# EAGLE schematic k-25m (EAGLE 7.5.0)
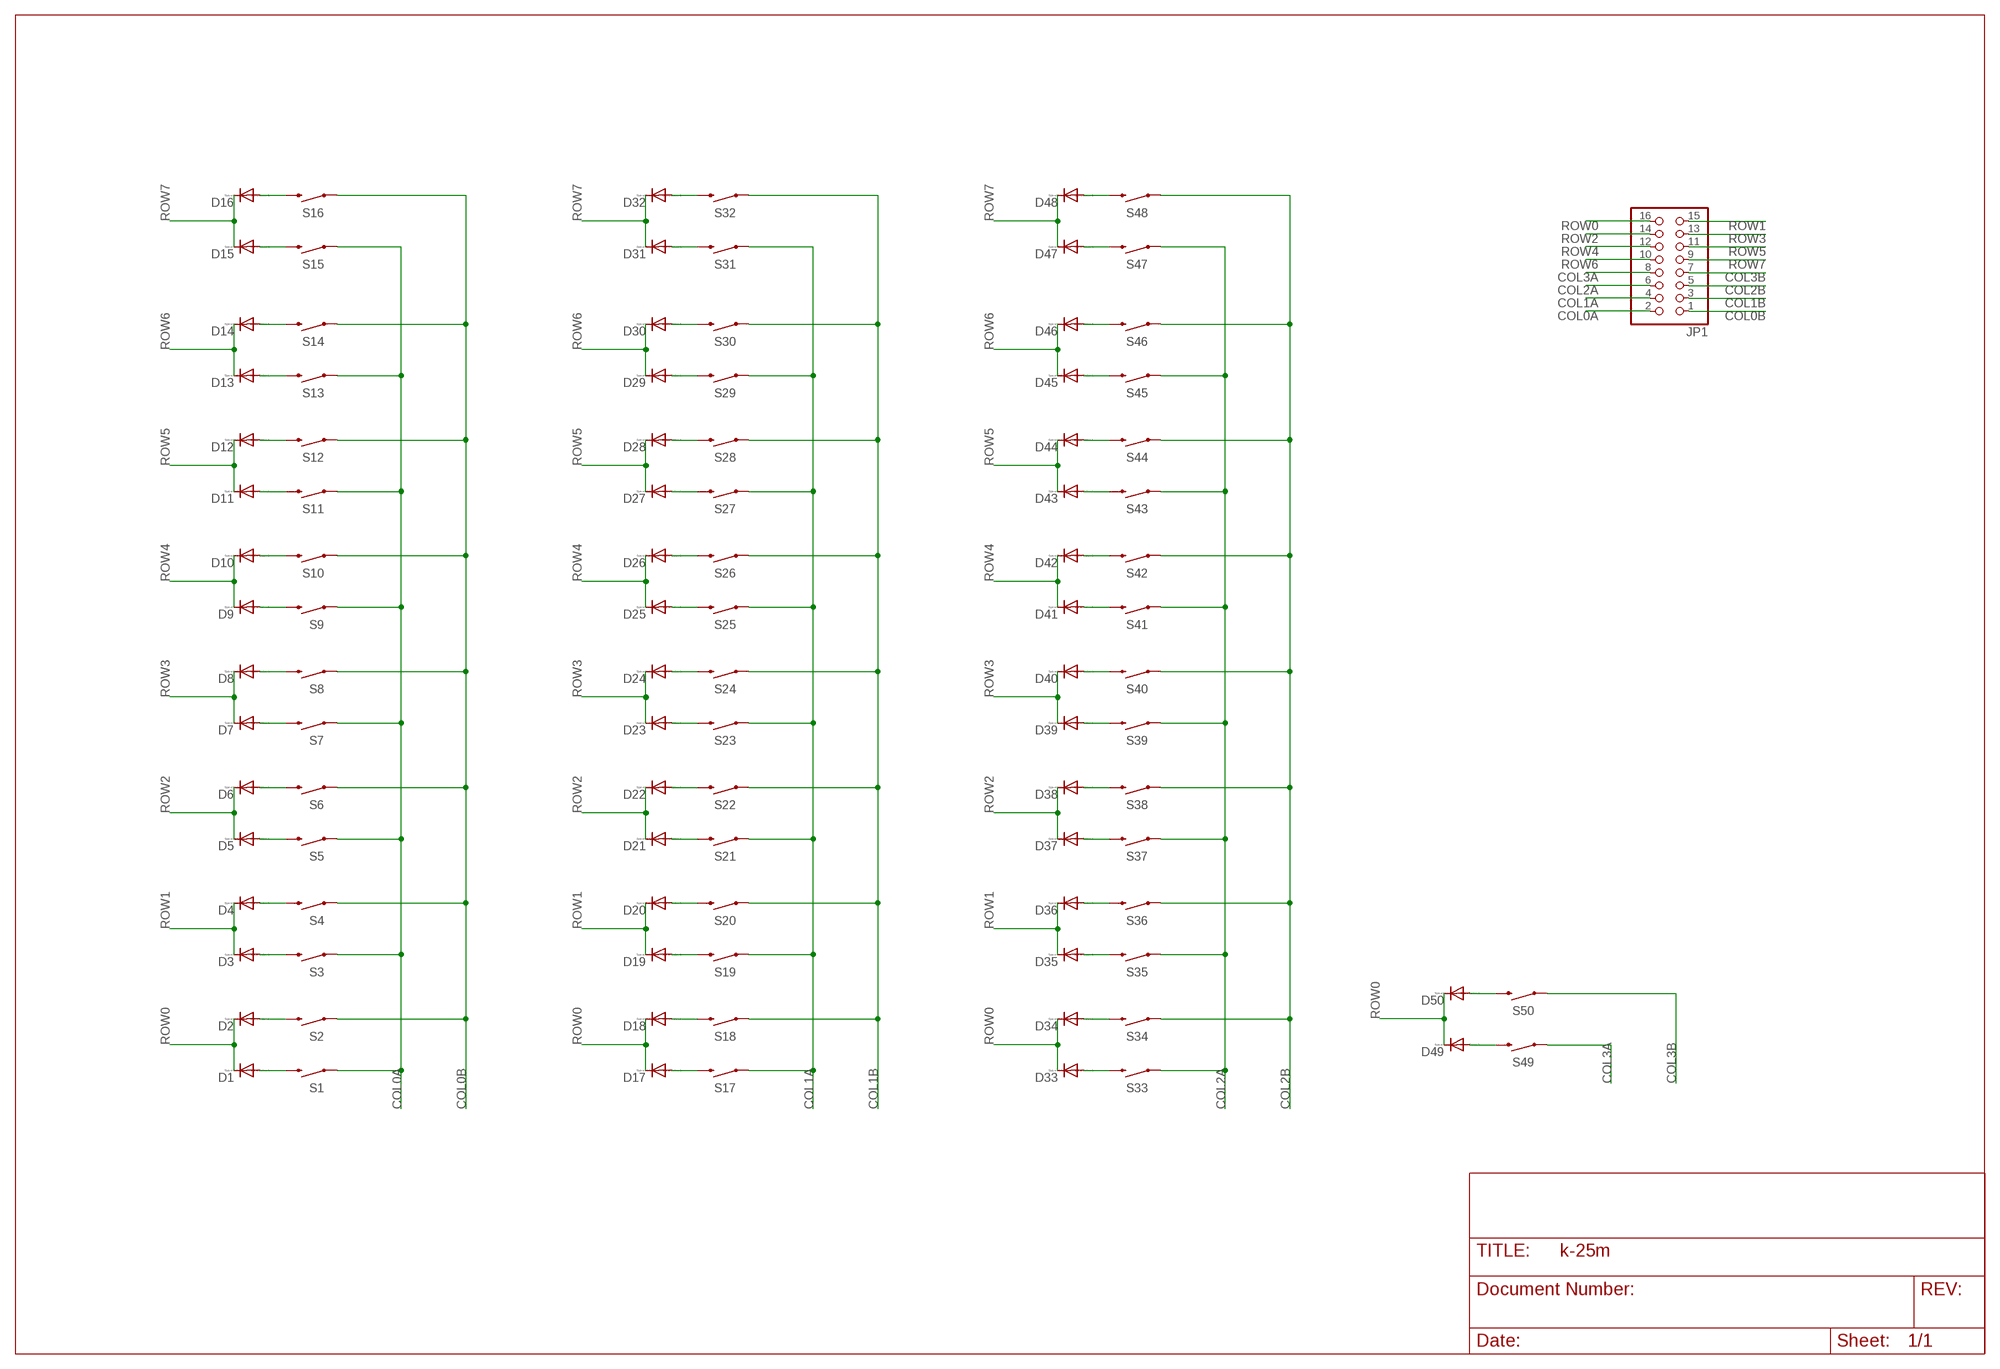
[diagram p0: schematic, sheet 1]

## Parts
D1  1N4148DO35-10  [DO35-10]
D2  1N4148DO35-10  [DO35-10]
D3  1N4148DO35-10  [DO35-10]
D4  1N4148DO35-10  [DO35-10]
D5  1N4148DO35-10  [DO35-10]
D6  1N4148DO35-10  [DO35-10]
D7  1N4148DO35-10  [DO35-10]
D8  1N4148DO35-10  [DO35-10]
D9  1N4148DO35-10  [DO35-10]
D10  1N4148DO35-10  [DO35-10]
D11  1N4148DO35-10  [DO35-10]
D12  1N4148DO35-10  [DO35-10]
D13  1N4148DO35-10  [DO35-10]
D14  1N4148DO35-10  [DO35-10]
D15  1N4148DO35-10  [DO35-10]
D16  1N4148DO35-10  [DO35-10]
D17  1N4148DO35-10  [DO35-10]
D18  1N4148DO35-10  [DO35-10]
D19  1N4148DO35-10  [DO35-10]
D20  1N4148DO35-10  [DO35-10]
D21  1N4148DO35-10  [DO35-10]
D22  1N4148DO35-10  [DO35-10]
D23  1N4148DO35-10  [DO35-10]
D24  1N4148DO35-10  [DO35-10]
D25  1N4148DO35-10  [DO35-10]
D26  1N4148DO35-10  [DO35-10]
D27  1N4148DO35-10  [DO35-10]
D28  1N4148DO35-10  [DO35-10]
D29  1N4148DO35-10  [DO35-10]
D30  1N4148DO35-10  [DO35-10]
D31  1N4148DO35-10  [DO35-10]
D32  1N4148DO35-10  [DO35-10]
D33  1N4148DO35-10  [DO35-10]
D34  1N4148DO35-10  [DO35-10]
D35  1N4148DO35-10  [DO35-10]
D36  1N4148DO35-10  [DO35-10]
D37  1N4148DO35-10  [DO35-10]
D38  1N4148DO35-10  [DO35-10]
D39  1N4148DO35-10  [DO35-10]
D40  1N4148DO35-10  [DO35-10]
D41  1N4148DO35-10  [DO35-10]
D42  1N4148DO35-10  [DO35-10]
D43  1N4148DO35-10  [DO35-10]
D44  1N4148DO35-10  [DO35-10]
D45  1N4148DO35-10  [DO35-10]
D46  1N4148DO35-10  [DO35-10]
D47  1N4148DO35-10  [DO35-10]
D48  1N4148DO35-10  [DO35-10]
D49  1N4148DO35-10  [DO35-10]
D50  1N4148DO35-10  [DO35-10]
JP1  HEADER-2X8  [2X08]
S1  SWITCHES_-SMD-1101NE  [TACTILE-SWITCH-1101NE]
S2  SWITCHES_-SMD-1101NE  [TACTILE-SWITCH-1101NE]
S3  SWITCHES_-SMD-1101NE  [TACTILE-SWITCH-1101NE]
S4  SWITCHES_-SMD-1101NE  [TACTILE-SWITCH-1101NE]
S5  SWITCHES_-SMD-1101NE  [TACTILE-SWITCH-1101NE]
S6  SWITCHES_-SMD-1101NE  [TACTILE-SWITCH-1101NE]
S7  SWITCHES_-SMD-1101NE  [TACTILE-SWITCH-1101NE]
S8  SWITCHES_-SMD-1101NE  [TACTILE-SWITCH-1101NE]
S9  SWITCHES_-SMD-1101NE  [TACTILE-SWITCH-1101NE]
S10  SWITCHES_-SMD-1101NE  [TACTILE-SWITCH-1101NE]
S11  SWITCHES_-SMD-1101NE  [TACTILE-SWITCH-1101NE]
S12  SWITCHES_-SMD-1101NE  [TACTILE-SWITCH-1101NE]
S13  SWITCHES_-SMD-1101NE  [TACTILE-SWITCH-1101NE]
S14  SWITCHES_-SMD-1101NE  [TACTILE-SWITCH-1101NE]
S15  SWITCHES_-SMD-1101NE  [TACTILE-SWITCH-1101NE]
S16  SWITCHES_-SMD-1101NE  [TACTILE-SWITCH-1101NE]
S17  SWITCHES_-SMD-1101NE  [TACTILE-SWITCH-1101NE]
S18  SWITCHES_-SMD-1101NE  [TACTILE-SWITCH-1101NE]
S19  SWITCHES_-SMD-1101NE  [TACTILE-SWITCH-1101NE]
S20  SWITCHES_-SMD-1101NE  [TACTILE-SWITCH-1101NE]
S21  SWITCHES_-SMD-1101NE  [TACTILE-SWITCH-1101NE]
S22  SWITCHES_-SMD-1101NE  [TACTILE-SWITCH-1101NE]
S23  SWITCHES_-SMD-1101NE  [TACTILE-SWITCH-1101NE]
S24  SWITCHES_-SMD-1101NE  [TACTILE-SWITCH-1101NE]
S25  SWITCHES_-SMD-1101NE  [TACTILE-SWITCH-1101NE]
S26  SWITCHES_-SMD-1101NE  [TACTILE-SWITCH-1101NE]
S27  SWITCHES_-SMD-1101NE  [TACTILE-SWITCH-1101NE]
S28  SWITCHES_-SMD-1101NE  [TACTILE-SWITCH-1101NE]
S29  SWITCHES_-SMD-1101NE  [TACTILE-SWITCH-1101NE]
S30  SWITCHES_-SMD-1101NE  [TACTILE-SWITCH-1101NE]
S31  SWITCHES_-SMD-1101NE  [TACTILE-SWITCH-1101NE]
S32  SWITCHES_-SMD-1101NE  [TACTILE-SWITCH-1101NE]
S33  SWITCHES_-SMD-1101NE  [TACTILE-SWITCH-1101NE]
S34  SWITCHES_-SMD-1101NE  [TACTILE-SWITCH-1101NE]
S35  SWITCHES_-SMD-1101NE  [TACTILE-SWITCH-1101NE]
S36  SWITCHES_-SMD-1101NE  [TACTILE-SWITCH-1101NE]
S37  SWITCHES_-SMD-1101NE  [TACTILE-SWITCH-1101NE]
S38  SWITCHES_-SMD-1101NE  [TACTILE-SWITCH-1101NE]
S39  SWITCHES_-SMD-1101NE  [TACTILE-SWITCH-1101NE]
S40  SWITCHES_-SMD-1101NE  [TACTILE-SWITCH-1101NE]
S41  SWITCHES_-SMD-1101NE  [TACTILE-SWITCH-1101NE]
S42  SWITCHES_-SMD-1101NE  [TACTILE-SWITCH-1101NE]
S43  SWITCHES_-SMD-1101NE  [TACTILE-SWITCH-1101NE]
S44  SWITCHES_-SMD-1101NE  [TACTILE-SWITCH-1101NE]
S45  SWITCHES_-SMD-1101NE  [TACTILE-SWITCH-1101NE]
S46  SWITCHES_-SMD-1101NE  [TACTILE-SWITCH-1101NE]
S47  SWITCHES_-SMD-1101NE  [TACTILE-SWITCH-1101NE]
S48  SWITCHES_-SMD-1101NE  [TACTILE-SWITCH-1101NE]
S49  SWITCHES_-SMD-1101NE  [TACTILE-SWITCH-1101NE]
S50  SWITCHES_-SMD-1101NE  [TACTILE-SWITCH-1101NE]

## Nets
COL0A: JP1.2 S1.P$1 S3.P$1 S5.P$1 S7.P$1 S9.P$1 S11.P$1 S13.P$1 S15.P$1
COL0B: JP1.1 S2.P$1 S4.P$1 S6.P$1 S8.P$1 S10.P$1 S12.P$1 S14.P$1 S16.P$1
COL1A: JP1.4 S17.P$1 S19.P$1 S21.P$1 S23.P$1 S25.P$1 S27.P$1 S29.P$1 S31.P$1
COL1B: JP1.3 S18.P$1 S20.P$1 S22.P$1 S24.P$1 S26.P$1 S28.P$1 S30.P$1 S32.P$1
COL2A: JP1.6 S33.P$1 S35.P$1 S37.P$1 S39.P$1 S41.P$1 S43.P$1 S45.P$1 S47.P$1
COL2B: JP1.5 S34.P$1 S36.P$1 S38.P$1 S40.P$1 S42.P$1 S44.P$1 S46.P$1 S48.P$1
COL3A: JP1.8 S49.P$1
COL3B: JP1.7 S50.P$1
N$1: D3.A S3.P$2
N$2: D1.A S1.P$2
N$3: D2.A S2.P$2
N$4: D4.A S4.P$2
N$5: D5.A S5.P$2
N$6: D6.A S6.P$2
N$7: D7.A S7.P$2
N$8: D8.A S8.P$2
N$9: D9.A S9.P$2
N$10: D10.A S10.P$2
N$11: D11.A S11.P$2
N$12: D12.A S12.P$2
N$13: D13.A S13.P$2
N$14: D14.A S14.P$2
N$15: D15.A S15.P$2
N$16: D16.A S16.P$2
N$17: D17.A S17.P$2
N$18: D18.A S18.P$2
N$19: D19.A S19.P$2
N$20: D20.A S20.P$2
N$21: D21.A S21.P$2
N$22: D22.A S22.P$2
N$23: D23.A S23.P$2
N$24: D24.A S24.P$2
N$25: D25.A S25.P$2
N$26: D26.A S26.P$2
N$27: D27.A S27.P$2
N$28: D28.A S28.P$2
N$29: D29.A S29.P$2
N$30: D30.A S30.P$2
N$31: D31.A S31.P$2
N$32: D32.A S32.P$2
N$33: D33.A S33.P$2
N$34: D34.A S34.P$2
N$35: D35.A S35.P$2
N$36: D36.A S36.P$2
N$37: D37.A S37.P$2
N$38: D38.A S38.P$2
N$39: D39.A S39.P$2
N$40: D40.A S40.P$2
N$41: D41.A S41.P$2
N$42: D42.A S42.P$2
N$43: D43.A S43.P$2
N$44: D44.A S44.P$2
N$45: D45.A S45.P$2
N$46: D46.A S46.P$2
N$47: D47.A S47.P$2
N$48: D48.A S48.P$2
N$49: D49.A S49.P$2
N$50: D50.A S50.P$2
ROW0: D1.C D2.C D17.C D18.C D33.C D34.C D49.C D50.C JP1.16
ROW1: D3.C D4.C D19.C D20.C D35.C D36.C JP1.15
ROW2: D5.C D6.C D21.C D22.C D37.C D38.C JP1.14
ROW3: D7.C D8.C D23.C D24.C D39.C D40.C JP1.13
ROW4: D9.C D10.C D25.C D26.C D41.C D42.C JP1.12
ROW5: D11.C D12.C D27.C D28.C D43.C D44.C JP1.11
ROW6: D13.C D14.C D29.C D30.C D45.C D46.C JP1.10
ROW7: D15.C D16.C D31.C D32.C D47.C D48.C JP1.9

## Library data of the parts
D1-D50 = diode:1N4148: DIODE high speed (Philips)
JP1 = microbuilder:HEADER-2X8
S1-S50 = EAGLE_BoosterPack_Library:SWITCHES_: Various NO switches- pushbuttons, reed, etc